# Altium schematic sheet FPGA_MISC.SchDoc: TE0890 - S7Mini
size A4; Organization: Trenz Electronic GmbH; DocumentNumber: TE0890; Revision: 01; SheetNumber: 4; SheetTotal: 6; Date: 2018-08-06; Author: Vitali Tsiukala; CompanyName: Trenz Electronic GmbH; DrawnBy: Vitali Tsiukala; Engineer: Vitali Tsiukala; ProjectName: TE0723 Arduino
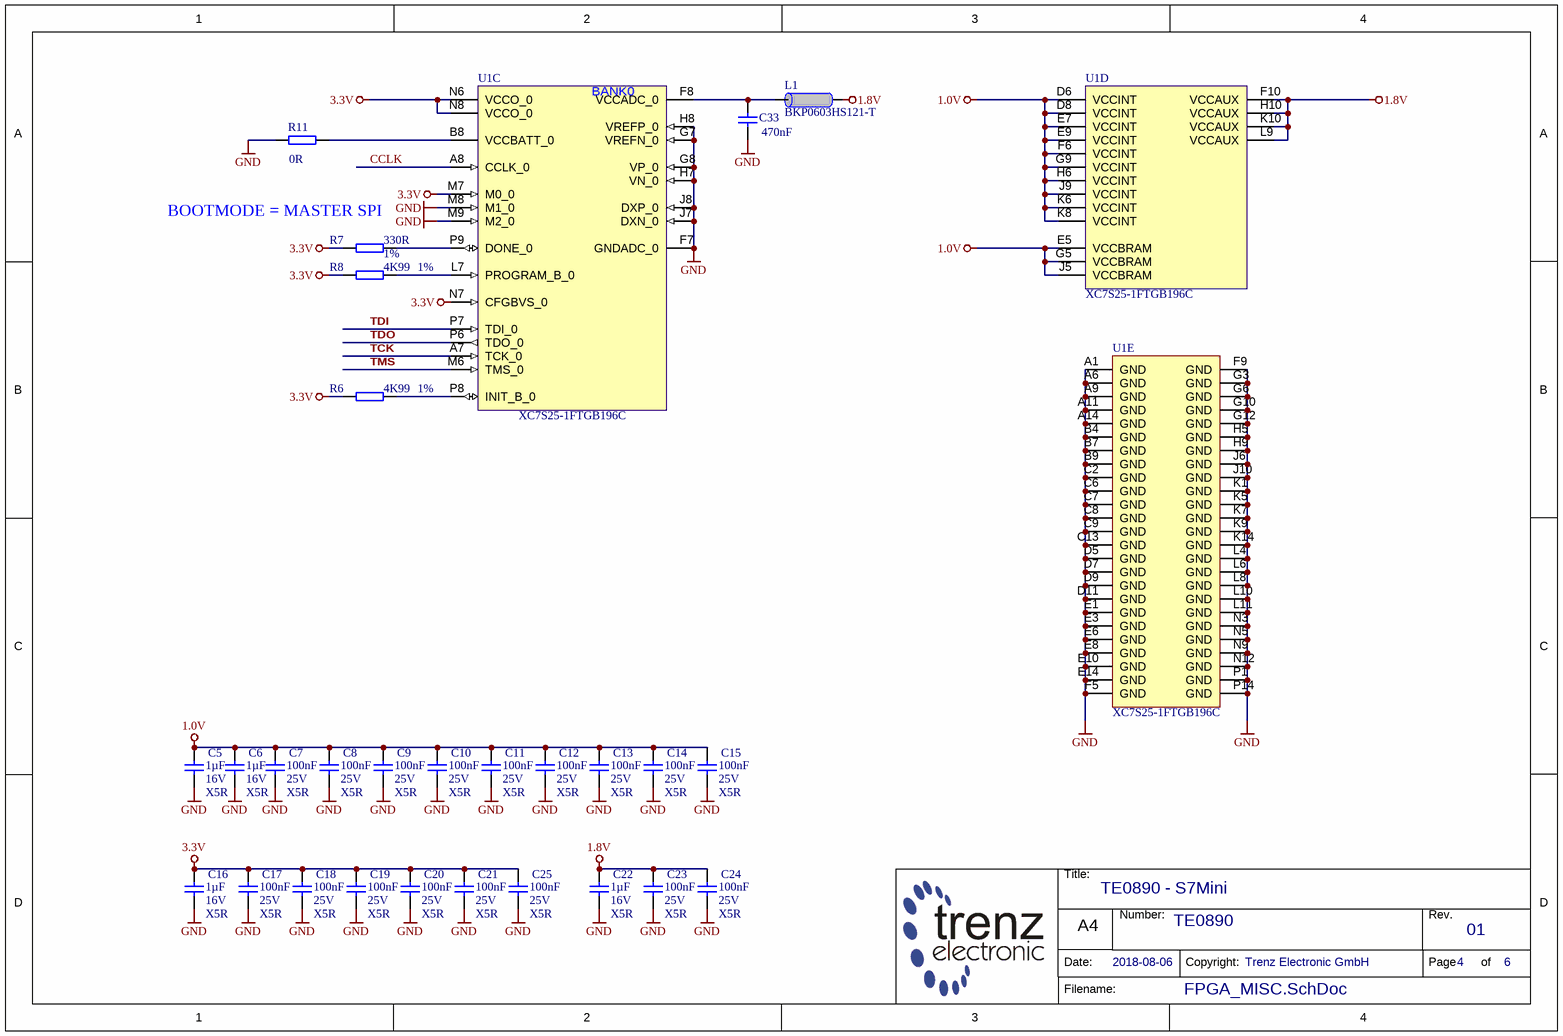
[diagram p0: FPGA_MISC.SchDoc]

## Parts
C5  1µF  Voltage: 16V  Technology: X5R  [CAPC1005X55N]
C6  1µF  Voltage: 16V  Technology: X5R  [CAPC1005X55N]
C7  100nF  Voltage: 25V  Technology: X5R  [CAPC1005X55N]
C8  100nF  Voltage: 25V  Technology: X5R  [CAPC1005X55N]
C9  100nF  Voltage: 25V  Technology: X5R  [CAPC1005X55N]
C10  100nF  Voltage: 25V  Technology: X5R  [CAPC1005X55N]
C11  100nF  Voltage: 25V  Technology: X5R  [CAPC1005X55N]
C12  100nF  Voltage: 25V  Technology: X5R  [CAPC1005X55N]
C13  100nF  Voltage: 25V  Technology: X5R  [CAPC1005X55N]
C14  100nF  Voltage: 25V  Technology: X5R  [CAPC1005X55N]
C15  100nF  Voltage: 25V  Technology: X5R  [CAPC1005X55N]
C16  1µF  Voltage: 16V  Technology: X5R  [CAPC1005X55N]
C17  100nF  Voltage: 25V  Technology: X5R  [CAPC1005X55N]
C18  100nF  Voltage: 25V  Technology: X5R  [CAPC1005X55N]
C19  100nF  Voltage: 25V  Technology: X5R  [CAPC1005X55N]
C20  100nF  Voltage: 25V  Technology: X5R  [CAPC1005X55N]
C21  100nF  Voltage: 25V  Technology: X5R  [CAPC1005X55N]
C22  1µF  Voltage: 16V  Technology: X5R  [CAPC1005X55N]
C23  100nF  Voltage: 25V  Technology: X5R  [CAPC1005X55N]
C24  100nF  Voltage: 25V  Technology: X5R  [CAPC1005X55N]
C25  100nF  Voltage: 25V  Technology: X5R  [CAPC1005X55N]
C33  470nF  [CAPC0603X33N]
L1  BKP0603HS121-T  [INDC0603X33N]
R6  4K99  Tolerance: 1%  [RESC1005X40N]
R7  330R  Tolerance: 1%  [RESC1005X40N]
R8  4K99  Tolerance: 1%  [RESC1005X40N]
R11  0R  [RESC1005X40N]
U1  XC7S25-1FTGB196C  [BGA196C100P14X14_1500X1500X155B50N]  (parts C,D,E of 5)

## Nets
1.0V: C5.1 C6.1 C7.1 C8.1 C9.1 C10.1 C11.1 C12.1 C13.1 C14.1 C15.1 U1.D6(VCCINT) U1.D8(VCCINT) U1.E5(VCCBRAM) U1.E7(VCCINT) U1.E9(VCCINT) U1.F6(VCCINT) U1.G5(VCCBRAM) U1.G9(VCCINT) U1.H6(VCCINT) U1.J5(VCCBRAM) U1.J9(VCCINT) U1.K6(VCCINT) U1.K8(VCCINT)
1.8V: C22.1 C23.1 C24.1 L1.1 U1.F10(VCCAUX) U1.H10(VCCAUX) U1.K10(VCCAUX) U1.L9(VCCAUX)
3.3V: C16.1 C17.1 C18.1 C19.1 C20.1 C21.1 C25.1 R6.1 R7.1 R8.1 U1.M7(M0_0) U1.N6(VCCO_0) U1.N7(CFGBVS_0) U1.N8(VCCO_0)
GND: C5.2 C6.2 C7.2 C8.2 C9.2 C10.2 C11.2 C12.2 C13.2 C14.2 C15.2 C16.2 C17.2 C18.2 C19.2 C20.2 C21.2 C22.2 C23.2 C24.2 C25.2 C33.2 R11.1 U1.A1(GND) U1.A6(GND) U1.A9(GND) U1.A11(GND) U1.A14(GND) U1.B4(GND) U1.B7(GND) U1.B9(GND) U1.C2(GND) U1.C6(GND) U1.C7(GND) U1.C8(GND) U1.C9(GND) U1.C13(GND) U1.D5(GND) U1.D7(GND) U1.D9(GND) U1.D11(GND) U1.E1(GND) U1.E3(GND) U1.E6(GND) U1.E8(GND) U1.E10(GND) U1.E14(GND) U1.F5(GND) U1.F7(GNDADC_0) U1.F9(GND) U1.G3(GND) U1.G6(GND) U1.G7(VREFN_0) U1.G8(VP_0) U1.G10(GND) U1.G12(GND) U1.H5(GND) U1.H7(VN_0) U1.H8(VREFP_0) U1.H9(GND) U1.J6(GND) U1.J7(DXN_0) U1.J8(DXP_0) U1.J10(GND) U1.K1(GND) U1.K5(GND) U1.K7(GND) U1.K9(GND) U1.K14(GND) U1.L4(GND) U1.L6(GND) U1.L8(GND) U1.L10(GND) U1.L11(GND) U1.M8(M1_0) U1.M9(M2_0) U1.N3(GND) U1.N5(GND) U1.N9(GND) U1.N12(GND) U1.P1(GND) U1.P14(GND)
CCLK: U1.A8(CCLK_0)
TCK: U1.A7(TCK_0)
TDI: U1.P7(TDI_0)
TDO: U1.P6(TDO_0)
TMS: U1.M6(TMS_0)
NetC33_1: C33.1 L1.2 U1.F8(VCCADC_0)
NetR6_2: R6.2 U1.P8(INIT_B_0)
NetR7_2: R7.2 U1.P9(DONE_0)
NetR8_2: R8.2 U1.L7(PROGRAM_B_0)
NetR11_2: R11.2 U1.B8(VCCBATT_0)

## Notes on the sheet
- (near R7) BOOTMODE = MASTER SPI
- Title:
- Number:
- Rev.
- Date:
- A4
- Copyright:
- Page
- of
- Filename:
- (in symbol 29276, part C) BANK0

## Library data of the parts
C5 C6 C16 C22 = 26579: KON 1µF 16V X5R 10% SMD BF 1005 (0402); AN: 26579; Mixed: SMT; Value: 1u; Temperature-Range: -55/+85; Case: 1005 (0402); Tolerance: 10%
C7-C15 C17-C21 C23-C25 = 22472: KON 100nF 25V X5R ±10% SMD BF 1005 (0402); AN: 22472; Mixed: SMT; Value: 100n; Preferred: Yes; Temperature-Range: -55/+85; Case: 1005 (0402)
C33 = 24921: KON 470nF 6.3V X5R 20%  SMD BF 0603 (0201); AN: 24921; Value: 470n; Mixed: SMT; Preferred: Yes; Temperature-Range: -55/+85; Case: 0603 (0201); Voltage: 6.3V; Technology: X5R; Tolerance: 20%
L1 = 25393: Ferritdurchführung SMD 0201, BKP0603HS121-T; AN: 25393; Mixed: SMT; Preferred: Yes; Tolerance: 25%; Temperature-Range: -55/+85; Case: 0603 (0201); HelpURL: B:\AD\adlib\datasheet\MULTILAYER CHIP BEAD INDUCTORS BK; Trenz-Stock: Yes; H-ART: BKP0603HS121-T
R6 R8 = 22754: WID SMD 4K99 1% 0,063W; AN: 22754; Value: 4.99K; Mixed: SMT; Preferred: Yes; H-ART: RC0402FR-074K99L; Case: 1005 (0402); Technology: TK100
R7 = 22762: WID SMD 330R 1% 0,063W  BF 1005 (0402); AN: 22762; Value: 330; Mixed: SMT; Preferred: Yes; H-ART: RC0402FR-13330RL; Case: 1005 (0402); Technology: TK100
R11 = 22738: WID SMD 0R; AN: 22738; Mixed: SMT; Value: 0; Preferred: Yes; Tolerance: 1%; H-ART: RC0402JR-070RL; Case: 1005 (0402); Technology: TK100
U1 = 29276: AN: 29276; Mixed: SMT; Temperature-Range: 0/+85; Case: FTGB196; HelpURL: B:\AD\adlib\datasheet\XC7; H-ART: XC7S25-1FTGB196C